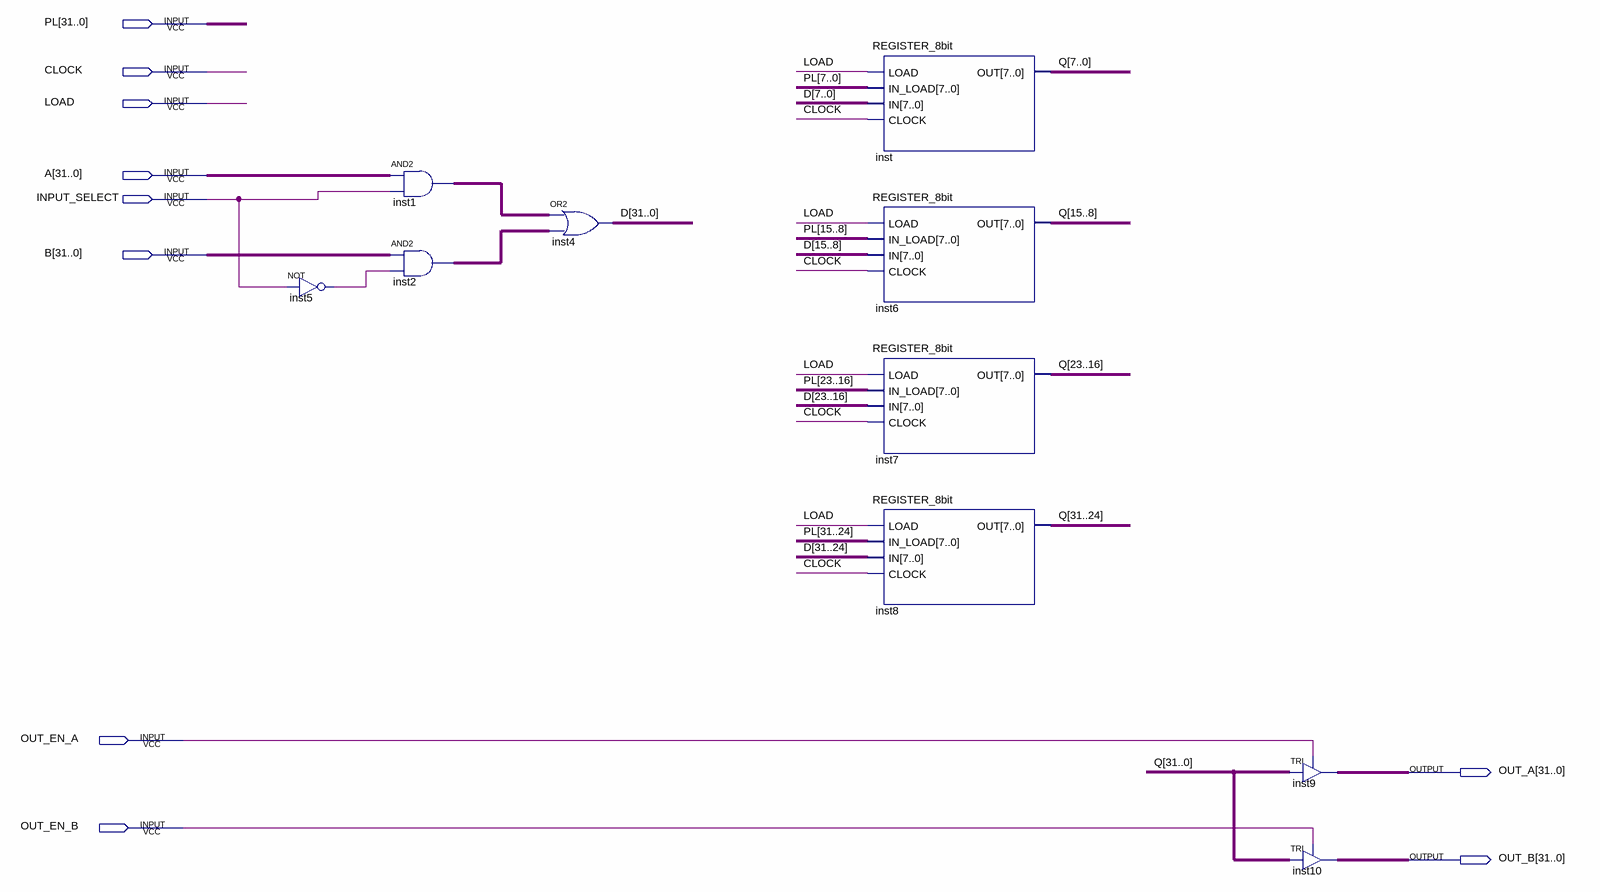
[diagram p0: schematic sheet]
// Quartus schematic REGISTRADOR_32bits.bdf as structural Verilog: 10 symbols, 10 pins
module REGISTRADOR_32bits (
  input  [31:0] PL,
  input  CLOCK,
  input  LOAD,
  input  [31:0] A,
  input  INPUT_SELECT,
  input  [31:0] B,
  input  OUT_EN_A,
  input  OUT_EN_B,
  output [31:0] OUT_A,
  output [31:0] OUT_B
);

  wire inst5_out;
  wire [31:0] D, inst1_out, inst2_out, Q;

  not inst5 (inst5_out, INPUT_SELECT);
  assign inst1_out = A & {32{INPUT_SELECT}};  // AND2 inst1, 32 bits wide
  assign inst2_out = B & {32{inst5_out}};  // AND2 inst2, 32 bits wide
  assign D = inst1_out | inst2_out;  // OR2 inst4, 32 bits wide
  REGISTER_8bit inst (.LOAD(LOAD), .IN_LOAD(PL[7:0]), .IN(D[7:0]), .CLOCK(CLOCK), .OUT(Q[7:0]));
  REGISTER_8bit inst6 (.LOAD(LOAD), .IN_LOAD(PL[15:8]), .IN(D[15:8]), .CLOCK(CLOCK), .OUT(Q[15:8]));
  REGISTER_8bit inst7 (.LOAD(LOAD), .IN_LOAD(PL[23:16]), .IN(D[23:16]), .CLOCK(CLOCK), .OUT(Q[23:16]));
  REGISTER_8bit inst8 (.LOAD(LOAD), .IN_LOAD(PL[31:24]), .IN(D[31:24]), .CLOCK(CLOCK), .OUT(Q[31:24]));
  TRI inst9[31:0] (.IN(Q), .OE(OUT_EN_A), .OUT(OUT_A));
  TRI inst10[31:0] (.IN(Q), .OE(OUT_EN_B), .OUT(OUT_B));
endmodule
